# Altium schematic sheet sptArray.SCHDOC: LiveDesign Evaluation - Video Games
size C; Organization: Altium Limited; Address1: L3, 12a Rodborough Rd; Address2: Frenchs Forest; Address3: NSW; Address4: Australia 2086; DocumentNumber: 7; SheetNumber: 7; SheetTotal: 13
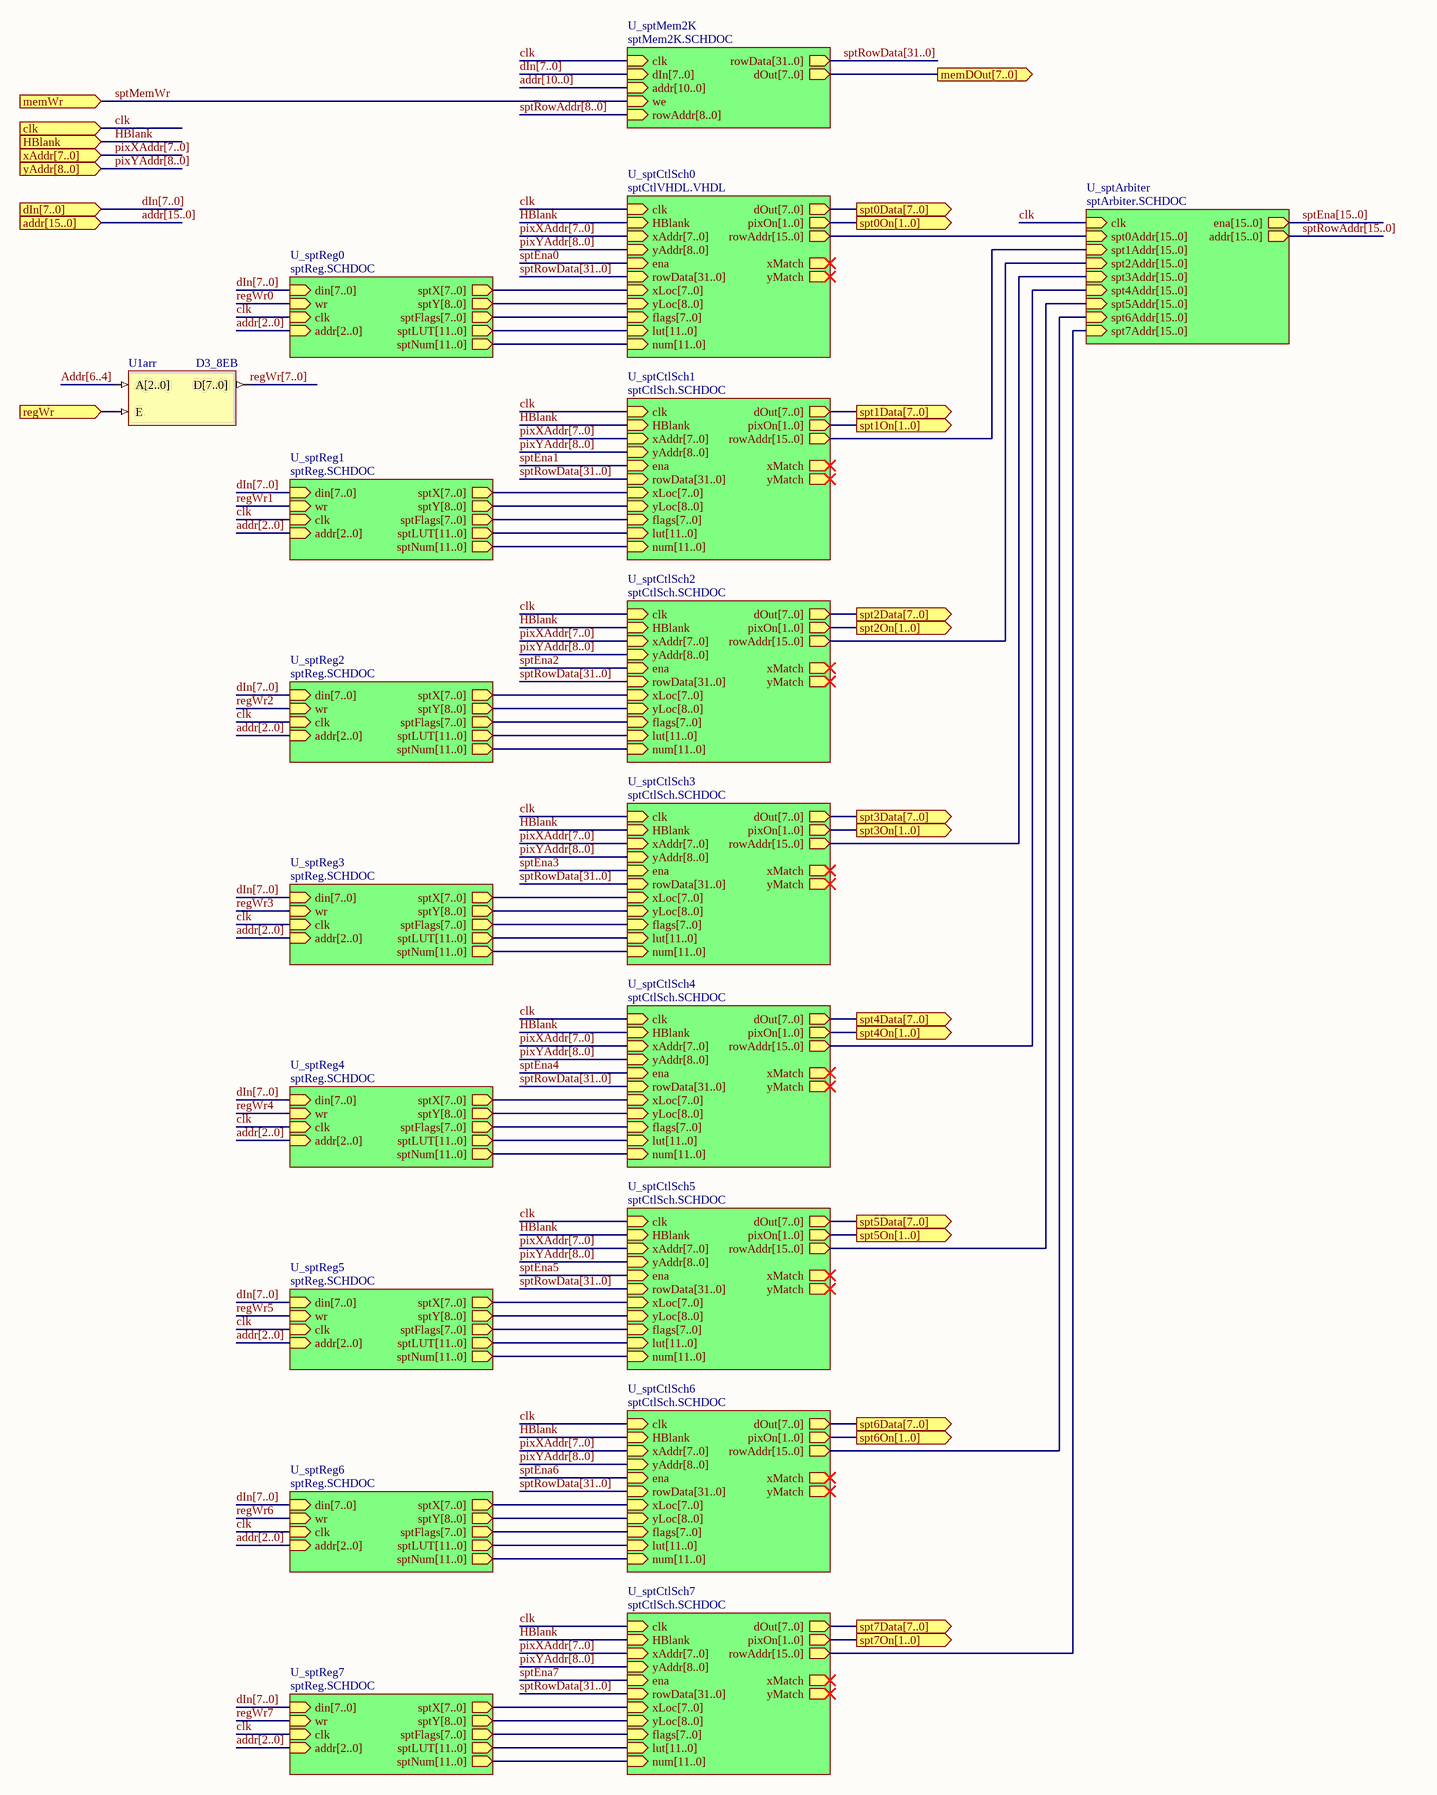
[diagram p0: sptArray.SCHDOC]

## Parts
U1arr  D3_8EB

## Sub-sheets
U_sptArbiter = sptArbiter.SCHDOC: ena[15..0] (out), clk (in), addr[15..0] (out), spt0Addr[15..0] (in), spt1Addr[15..0] (in), spt2Addr[15..0] (in), spt3Addr[15..0] (in), spt4Addr[15..0] (in), spt5Addr[15..0] (in), spt6Addr[15..0] (in), spt7Addr[15..0] (in)
U_sptCtlSch0 = sptCtlVHDL.VHDL: clk (in), HBlank (in), xAddr[7..0] (in), yAddr[8..0] (in), ena (in), xLoc[7..0] (in), rowData[31..0] (in), yLoc[8..0] (in), dOut[7..0] (out), rowAddr[15..0] (out), flags[7..0] (in), lut[11..0] (in), num[11..0] (in), pixOn[1..0] (out), xMatch (out), yMatch (out)  | VHDLENTITY: sptCtlVHDL
U_sptCtlSch1 = sptCtlSch.SCHDOC: clk (in), HBlank (in), xAddr[7..0] (in), yAddr[8..0] (in), ena (in), xLoc[7..0] (in), rowData[31..0] (in), yLoc[8..0] (in), dOut[7..0] (out), xMatch (out), yMatch (out), flags[7..0] (in), lut[11..0] (in), pixOn[1..0] (out), rowAddr[15..0] (out), num[11..0] (in)
U_sptCtlSch2 = sptCtlSch.SCHDOC: clk (in), HBlank (in), xAddr[7..0] (in), yAddr[8..0] (in), ena (in), xLoc[7..0] (in), rowData[31..0] (in), yLoc[8..0] (in), dOut[7..0] (out), xMatch (out), yMatch (out), flags[7..0] (in), lut[11..0] (in), pixOn[1..0] (out), rowAddr[15..0] (out), num[11..0] (in)
U_sptCtlSch3 = sptCtlSch.SCHDOC: clk (in), HBlank (in), xAddr[7..0] (in), yAddr[8..0] (in), ena (in), xLoc[7..0] (in), rowData[31..0] (in), yLoc[8..0] (in), dOut[7..0] (out), rowAddr[15..0] (out), xMatch (out), yMatch (out), flags[7..0] (in), lut[11..0] (in), num[11..0] (in), pixOn[1..0] (out)
U_sptCtlSch4 = sptCtlSch.SCHDOC: clk (in), HBlank (in), xAddr[7..0] (in), yAddr[8..0] (in), ena (in), xLoc[7..0] (in), rowData[31..0] (in), yLoc[8..0] (in), dOut[7..0] (out), rowAddr[15..0] (out), xMatch (out), yMatch (out), flags[7..0] (in), lut[11..0] (in), num[11..0] (in), pixOn[1..0] (out)
U_sptCtlSch5 = sptCtlSch.SCHDOC: clk (in), HBlank (in), xAddr[7..0] (in), yAddr[8..0] (in), ena (in), xLoc[7..0] (in), rowData[31..0] (in), yLoc[8..0] (in), dOut[7..0] (out), rowAddr[15..0] (out), xMatch (out), yMatch (out), flags[7..0] (in), lut[11..0] (in), num[11..0] (in), pixOn[1..0] (out)
U_sptCtlSch6 = sptCtlSch.SCHDOC: clk (in), HBlank (in), xAddr[7..0] (in), yAddr[8..0] (in), ena (in), xLoc[7..0] (in), rowData[31..0] (in), yLoc[8..0] (in), dOut[7..0] (out), rowAddr[15..0] (out), xMatch (out), yMatch (out), flags[7..0] (in), lut[11..0] (in), num[11..0] (in), pixOn[1..0] (out)
U_sptCtlSch7 = sptCtlSch.SCHDOC: clk (in), HBlank (in), xAddr[7..0] (in), yAddr[8..0] (in), ena (in), xLoc[7..0] (in), rowData[31..0] (in), yLoc[8..0] (in), dOut[7..0] (out), rowAddr[15..0] (out), xMatch (out), yMatch (out), flags[7..0] (in), lut[11..0] (in), num[11..0] (in), pixOn[1..0] (out)
U_sptMem2K = sptMem2K.SCHDOC: clk (in), dIn[7..0] (in), addr[10..0] (in), we (in), rowData[31..0] (out), rowAddr[8..0] (in), dOut[7..0] (out)
U_sptReg0 = sptReg.SCHDOC: din[7..0] (in), wr (in), clk (in), sptX[7..0] (out), sptY[8..0] (out), sptFlags[7..0] (out), sptLUT[11..0] (out), addr[2..0] (in), sptNum[11..0] (out)
U_sptReg1 = sptReg.SCHDOC: din[7..0] (in), wr (in), clk (in), sptX[7..0] (out), sptY[8..0] (out), sptFlags[7..0] (out), sptLUT[11..0] (out), sptNum[11..0] (out), addr[2..0] (in)
U_sptReg2 = sptReg.SCHDOC: din[7..0] (in), wr (in), clk (in), sptX[7..0] (out), sptY[8..0] (out), sptFlags[7..0] (out), sptLUT[11..0] (out), sptNum[11..0] (out), addr[2..0] (in)
U_sptReg3 = sptReg.SCHDOC: din[7..0] (in), wr (in), clk (in), sptX[7..0] (out), sptY[8..0] (out), sptFlags[7..0] (out), sptLUT[11..0] (out), sptNum[11..0] (out), addr[2..0] (in)
U_sptReg4 = sptReg.SCHDOC: din[7..0] (in), wr (in), clk (in), sptX[7..0] (out), sptY[8..0] (out), sptFlags[7..0] (out), sptLUT[11..0] (out), sptNum[11..0] (out), addr[2..0] (in)
U_sptReg5 = sptReg.SCHDOC: din[7..0] (in), wr (in), clk (in), sptX[7..0] (out), sptY[8..0] (out), sptFlags[7..0] (out), sptLUT[11..0] (out), sptNum[11..0] (out), addr[2..0] (in)
U_sptReg6 = sptReg.SCHDOC: din[7..0] (in), wr (in), clk (in), sptX[7..0] (out), sptY[8..0] (out), sptFlags[7..0] (out), sptLUT[11..0] (out), sptNum[11..0] (out), addr[2..0] (in)
U_sptReg7 = sptReg.SCHDOC: din[7..0] (in), wr (in), clk (in), sptX[7..0] (out), sptY[8..0] (out), sptFlags[7..0] (out), sptLUT[11..0] (out), sptNum[11..0] (out), addr[2..0] (in)

## Ports
addr[15..0] (in), clk (in), dIn[7..0] (in), HBlank (in), memDOut[7..0] (out), memWr (in), regWr (in), spt0Data[7..0] (out), spt0On[1..0] (out), spt1Data[7..0] (out), spt1On[1..0] (out), spt2Data[7..0] (out), spt2On[1..0] (out), spt3Data[7..0] (out), spt3On[1..0] (out), spt4Data[7..0] (out), spt4On[1..0] (out), spt5Data[7..0] (out), spt5On[1..0] (out), spt6Data[7..0] (out), spt6On[1..0] (out), spt7Data[7..0] (out), spt7On[1..0] (out), xAddr[7..0] (in), yAddr[8..0] (in)

## Nets
Addr[6..4]: U1arr.A[2..0]
clk: port clk, sheet U_sptArbiter/clk, sheet U_sptCtlSch0/clk, sheet U_sptCtlSch1/clk, sheet U_sptCtlSch2/clk, sheet U_sptCtlSch3/clk, sheet U_sptCtlSch4/clk, sheet U_sptCtlSch5/clk, sheet U_sptCtlSch6/clk, sheet U_sptCtlSch7/clk, sheet U_sptReg0/clk, sheet U_sptReg1/clk, sheet U_sptReg2/clk, sheet U_sptReg3/clk, sheet U_sptReg4/clk, sheet U_sptReg5/clk, sheet U_sptReg6/clk, sheet U_sptReg7/clk, sheet U_sptMem2K/clk
HBlank: port HBlank, sheet U_sptCtlSch0/HBlank, sheet U_sptCtlSch1/HBlank, sheet U_sptCtlSch2/HBlank, sheet U_sptCtlSch3/HBlank, sheet U_sptCtlSch4/HBlank, sheet U_sptCtlSch5/HBlank, sheet U_sptCtlSch6/HBlank, sheet U_sptCtlSch7/HBlank
regWr: U1arr.E ; port regWr
regWr0: sheet U_sptReg0/wr
regWr1: sheet U_sptReg1/wr
regWr2: sheet U_sptReg2/wr
regWr3: sheet U_sptReg3/wr
regWr4: sheet U_sptReg4/wr
regWr5: sheet U_sptReg5/wr
regWr6: sheet U_sptReg6/wr
regWr7: sheet U_sptReg7/wr
regWr[7..0]: U1arr.D[7..0]
sptEna0: sheet U_sptCtlSch0/ena
sptEna1: sheet U_sptCtlSch1/ena
sptEna2: sheet U_sptCtlSch2/ena
sptEna3: sheet U_sptCtlSch3/ena
sptEna4: sheet U_sptCtlSch4/ena
sptEna5: sheet U_sptCtlSch5/ena
sptEna6: sheet U_sptCtlSch6/ena
sptEna7: sheet U_sptCtlSch7/ena
sptMemWr: port memWr, sheet U_sptMem2K/we

## Buses and harness runs
bus addr[2..0] = sheet U_sptReg0/addr[2..0]
bus addr[2..0] = sheet U_sptReg1/addr[2..0]
bus addr[2..0] = sheet U_sptReg2/addr[2..0]
bus addr[2..0] = sheet U_sptReg3/addr[2..0]
bus addr[2..0] = sheet U_sptReg4/addr[2..0]
bus addr[2..0] = sheet U_sptReg5/addr[2..0]
bus addr[2..0] = sheet U_sptReg6/addr[2..0]
bus addr[2..0] = sheet U_sptReg7/addr[2..0]
bus Addr[6..4]
bus addr[10..0] = sheet U_sptMem2K/addr[10..0]
bus addr[15..0] = port addr[15..0]
bus dIn[7..0] = port dIn[7..0]
bus dIn[7..0] = sheet U_sptMem2K/dIn[7..0]
bus dIn[7..0] = sheet U_sptReg0/din[7..0]
bus dIn[7..0] = sheet U_sptReg1/din[7..0]
bus dIn[7..0] = sheet U_sptReg2/din[7..0]
bus dIn[7..0] = sheet U_sptReg3/din[7..0]
bus dIn[7..0] = sheet U_sptReg4/din[7..0]
bus dIn[7..0] = sheet U_sptReg5/din[7..0]
bus dIn[7..0] = sheet U_sptReg6/din[7..0]
bus dIn[7..0] = sheet U_sptReg7/din[7..0]
bus pixXAddr[7..0] = port xAddr[7..0]
bus pixXAddr[7..0] = sheet U_sptCtlSch0/xAddr[7..0]
bus pixXAddr[7..0] = sheet U_sptCtlSch1/xAddr[7..0]
bus pixXAddr[7..0] = sheet U_sptCtlSch2/xAddr[7..0]
bus pixXAddr[7..0] = sheet U_sptCtlSch3/xAddr[7..0]
bus pixXAddr[7..0] = sheet U_sptCtlSch4/xAddr[7..0]
bus pixXAddr[7..0] = sheet U_sptCtlSch5/xAddr[7..0]
bus pixXAddr[7..0] = sheet U_sptCtlSch6/xAddr[7..0]
bus pixXAddr[7..0] = sheet U_sptCtlSch7/xAddr[7..0]
bus pixYAddr[8..0] = port yAddr[8..0]
bus pixYAddr[8..0] = sheet U_sptCtlSch0/yAddr[8..0]
bus pixYAddr[8..0] = sheet U_sptCtlSch1/yAddr[8..0]
bus pixYAddr[8..0] = sheet U_sptCtlSch2/yAddr[8..0]
bus pixYAddr[8..0] = sheet U_sptCtlSch3/yAddr[8..0]
bus pixYAddr[8..0] = sheet U_sptCtlSch4/yAddr[8..0]
bus pixYAddr[8..0] = sheet U_sptCtlSch5/yAddr[8..0]
bus pixYAddr[8..0] = sheet U_sptCtlSch6/yAddr[8..0]
bus pixYAddr[8..0] = sheet U_sptCtlSch7/yAddr[8..0]
bus port memDOut[7..0] = sheet U_sptMem2K/dOut[7..0]
bus port spt0Data[7..0] = sheet U_sptCtlSch0/dOut[7..0]
bus port spt0On[1..0] = sheet U_sptCtlSch0/pixOn[1..0]
bus port spt1Data[7..0] = sheet U_sptCtlSch1/dOut[7..0]
bus port spt1On[1..0] = sheet U_sptCtlSch1/pixOn[1..0]
bus port spt2Data[7..0] = sheet U_sptCtlSch2/dOut[7..0]
bus port spt2On[1..0] = sheet U_sptCtlSch2/pixOn[1..0]
bus port spt3Data[7..0] = sheet U_sptCtlSch3/dOut[7..0]
bus port spt3On[1..0] = sheet U_sptCtlSch3/pixOn[1..0]
bus port spt4Data[7..0] = sheet U_sptCtlSch4/dOut[7..0]
bus port spt4On[1..0] = sheet U_sptCtlSch4/pixOn[1..0]
bus port spt5Data[7..0] = sheet U_sptCtlSch5/dOut[7..0]
bus port spt5On[1..0] = sheet U_sptCtlSch5/pixOn[1..0]
bus port spt6Data[7..0] = sheet U_sptCtlSch6/dOut[7..0]
bus port spt6On[1..0] = sheet U_sptCtlSch6/pixOn[1..0]
bus port spt7Data[7..0] = sheet U_sptCtlSch7/dOut[7..0]
bus port spt7On[1..0] = sheet U_sptCtlSch7/pixOn[1..0]
bus regWr[7..0]
bus sheet U_sptArbiter/spt0Addr[15..0] = sheet U_sptCtlSch0/rowAddr[15..0]
bus sheet U_sptArbiter/spt1Addr[15..0] = sheet U_sptCtlSch1/rowAddr[15..0]
bus sheet U_sptArbiter/spt2Addr[15..0] = sheet U_sptCtlSch2/rowAddr[15..0]
bus sheet U_sptArbiter/spt3Addr[15..0] = sheet U_sptCtlSch3/rowAddr[15..0]
bus sheet U_sptArbiter/spt4Addr[15..0] = sheet U_sptCtlSch4/rowAddr[15..0]
bus sheet U_sptArbiter/spt5Addr[15..0] = sheet U_sptCtlSch5/rowAddr[15..0]
bus sheet U_sptArbiter/spt6Addr[15..0] = sheet U_sptCtlSch6/rowAddr[15..0]
bus sheet U_sptArbiter/spt7Addr[15..0] = sheet U_sptCtlSch7/rowAddr[15..0]
bus sheet U_sptCtlSch0/flags[7..0] = sheet U_sptReg0/sptFlags[7..0]
bus sheet U_sptCtlSch0/lut[11..0] = sheet U_sptReg0/sptLUT[11..0]
bus sheet U_sptCtlSch0/num[11..0] = sheet U_sptReg0/sptNum[11..0]
bus sheet U_sptCtlSch0/xLoc[7..0] = sheet U_sptReg0/sptX[7..0]
bus sheet U_sptCtlSch0/yLoc[8..0] = sheet U_sptReg0/sptY[8..0]
bus sheet U_sptCtlSch1/flags[7..0] = sheet U_sptReg1/sptFlags[7..0]
bus sheet U_sptCtlSch1/lut[11..0] = sheet U_sptReg1/sptLUT[11..0]
bus sheet U_sptCtlSch1/num[11..0] = sheet U_sptReg1/sptNum[11..0]
bus sheet U_sptCtlSch1/xLoc[7..0] = sheet U_sptReg1/sptX[7..0]
bus sheet U_sptCtlSch1/yLoc[8..0] = sheet U_sptReg1/sptY[8..0]
bus sheet U_sptCtlSch2/flags[7..0] = sheet U_sptReg2/sptFlags[7..0]
bus sheet U_sptCtlSch2/lut[11..0] = sheet U_sptReg2/sptLUT[11..0]
bus sheet U_sptCtlSch2/num[11..0] = sheet U_sptReg2/sptNum[11..0]
bus sheet U_sptCtlSch2/xLoc[7..0] = sheet U_sptReg2/sptX[7..0]
bus sheet U_sptCtlSch2/yLoc[8..0] = sheet U_sptReg2/sptY[8..0]
bus sheet U_sptCtlSch3/flags[7..0] = sheet U_sptReg3/sptFlags[7..0]
bus sheet U_sptCtlSch3/lut[11..0] = sheet U_sptReg3/sptLUT[11..0]
bus sheet U_sptCtlSch3/num[11..0] = sheet U_sptReg3/sptNum[11..0]
bus sheet U_sptCtlSch3/xLoc[7..0] = sheet U_sptReg3/sptX[7..0]
bus sheet U_sptCtlSch3/yLoc[8..0] = sheet U_sptReg3/sptY[8..0]
bus sheet U_sptCtlSch4/flags[7..0] = sheet U_sptReg4/sptFlags[7..0]
bus sheet U_sptCtlSch4/lut[11..0] = sheet U_sptReg4/sptLUT[11..0]
bus sheet U_sptCtlSch4/num[11..0] = sheet U_sptReg4/sptNum[11..0]
bus sheet U_sptCtlSch4/xLoc[7..0] = sheet U_sptReg4/sptX[7..0]
bus sheet U_sptCtlSch4/yLoc[8..0] = sheet U_sptReg4/sptY[8..0]
bus sheet U_sptCtlSch5/flags[7..0] = sheet U_sptReg5/sptFlags[7..0]
bus sheet U_sptCtlSch5/lut[11..0] = sheet U_sptReg5/sptLUT[11..0]
bus sheet U_sptCtlSch5/num[11..0] = sheet U_sptReg5/sptNum[11..0]
bus sheet U_sptCtlSch5/xLoc[7..0] = sheet U_sptReg5/sptX[7..0]
bus sheet U_sptCtlSch5/yLoc[8..0] = sheet U_sptReg5/sptY[8..0]
bus sheet U_sptCtlSch6/flags[7..0] = sheet U_sptReg6/sptFlags[7..0]
bus sheet U_sptCtlSch6/lut[11..0] = sheet U_sptReg6/sptLUT[11..0]
bus sheet U_sptCtlSch6/num[11..0] = sheet U_sptReg6/sptNum[11..0]
bus sheet U_sptCtlSch6/xLoc[7..0] = sheet U_sptReg6/sptX[7..0]
bus sheet U_sptCtlSch6/yLoc[8..0] = sheet U_sptReg6/sptY[8..0]
bus sheet U_sptCtlSch7/flags[7..0] = sheet U_sptReg7/sptFlags[7..0]
bus sheet U_sptCtlSch7/lut[11..0] = sheet U_sptReg7/sptLUT[11..0]
bus sheet U_sptCtlSch7/num[11..0] = sheet U_sptReg7/sptNum[11..0]
bus sheet U_sptCtlSch7/xLoc[7..0] = sheet U_sptReg7/sptX[7..0]
bus sheet U_sptCtlSch7/yLoc[8..0] = sheet U_sptReg7/sptY[8..0]
bus sptEna[15..0] = sheet U_sptArbiter/ena[15..0]
bus sptRowAddr[8..0] = sheet U_sptMem2K/rowAddr[8..0]
bus sptRowAddr[15..0] = sheet U_sptArbiter/addr[15..0]
bus sptRowData[31..0] = sheet U_sptCtlSch0/rowData[31..0]
bus sptRowData[31..0] = sheet U_sptCtlSch1/rowData[31..0]
bus sptRowData[31..0] = sheet U_sptCtlSch2/rowData[31..0]
bus sptRowData[31..0] = sheet U_sptCtlSch3/rowData[31..0]
bus sptRowData[31..0] = sheet U_sptCtlSch4/rowData[31..0]
bus sptRowData[31..0] = sheet U_sptCtlSch5/rowData[31..0]
bus sptRowData[31..0] = sheet U_sptCtlSch6/rowData[31..0]
bus sptRowData[31..0] = sheet U_sptCtlSch7/rowData[31..0]
bus sptRowData[31..0] = sheet U_sptMem2K/rowData[31..0]

## Notes on the sheet
- Title
- Size:
- Date:
- File:
- C
- Number:
- Time:
- Revision:
- Sheet
- of

## Library data of the parts
U1arr = D3_8EB: Binary 3- to 8-Bit Decoder with Enable, Bus Version; ArchiveName: GENERIC; Published: 18-Dec-2003; Publisher: Altium Limited; Core Revision: 1.00.00